# EAGLE design soil_sensor (EAGLE 9.6.2)
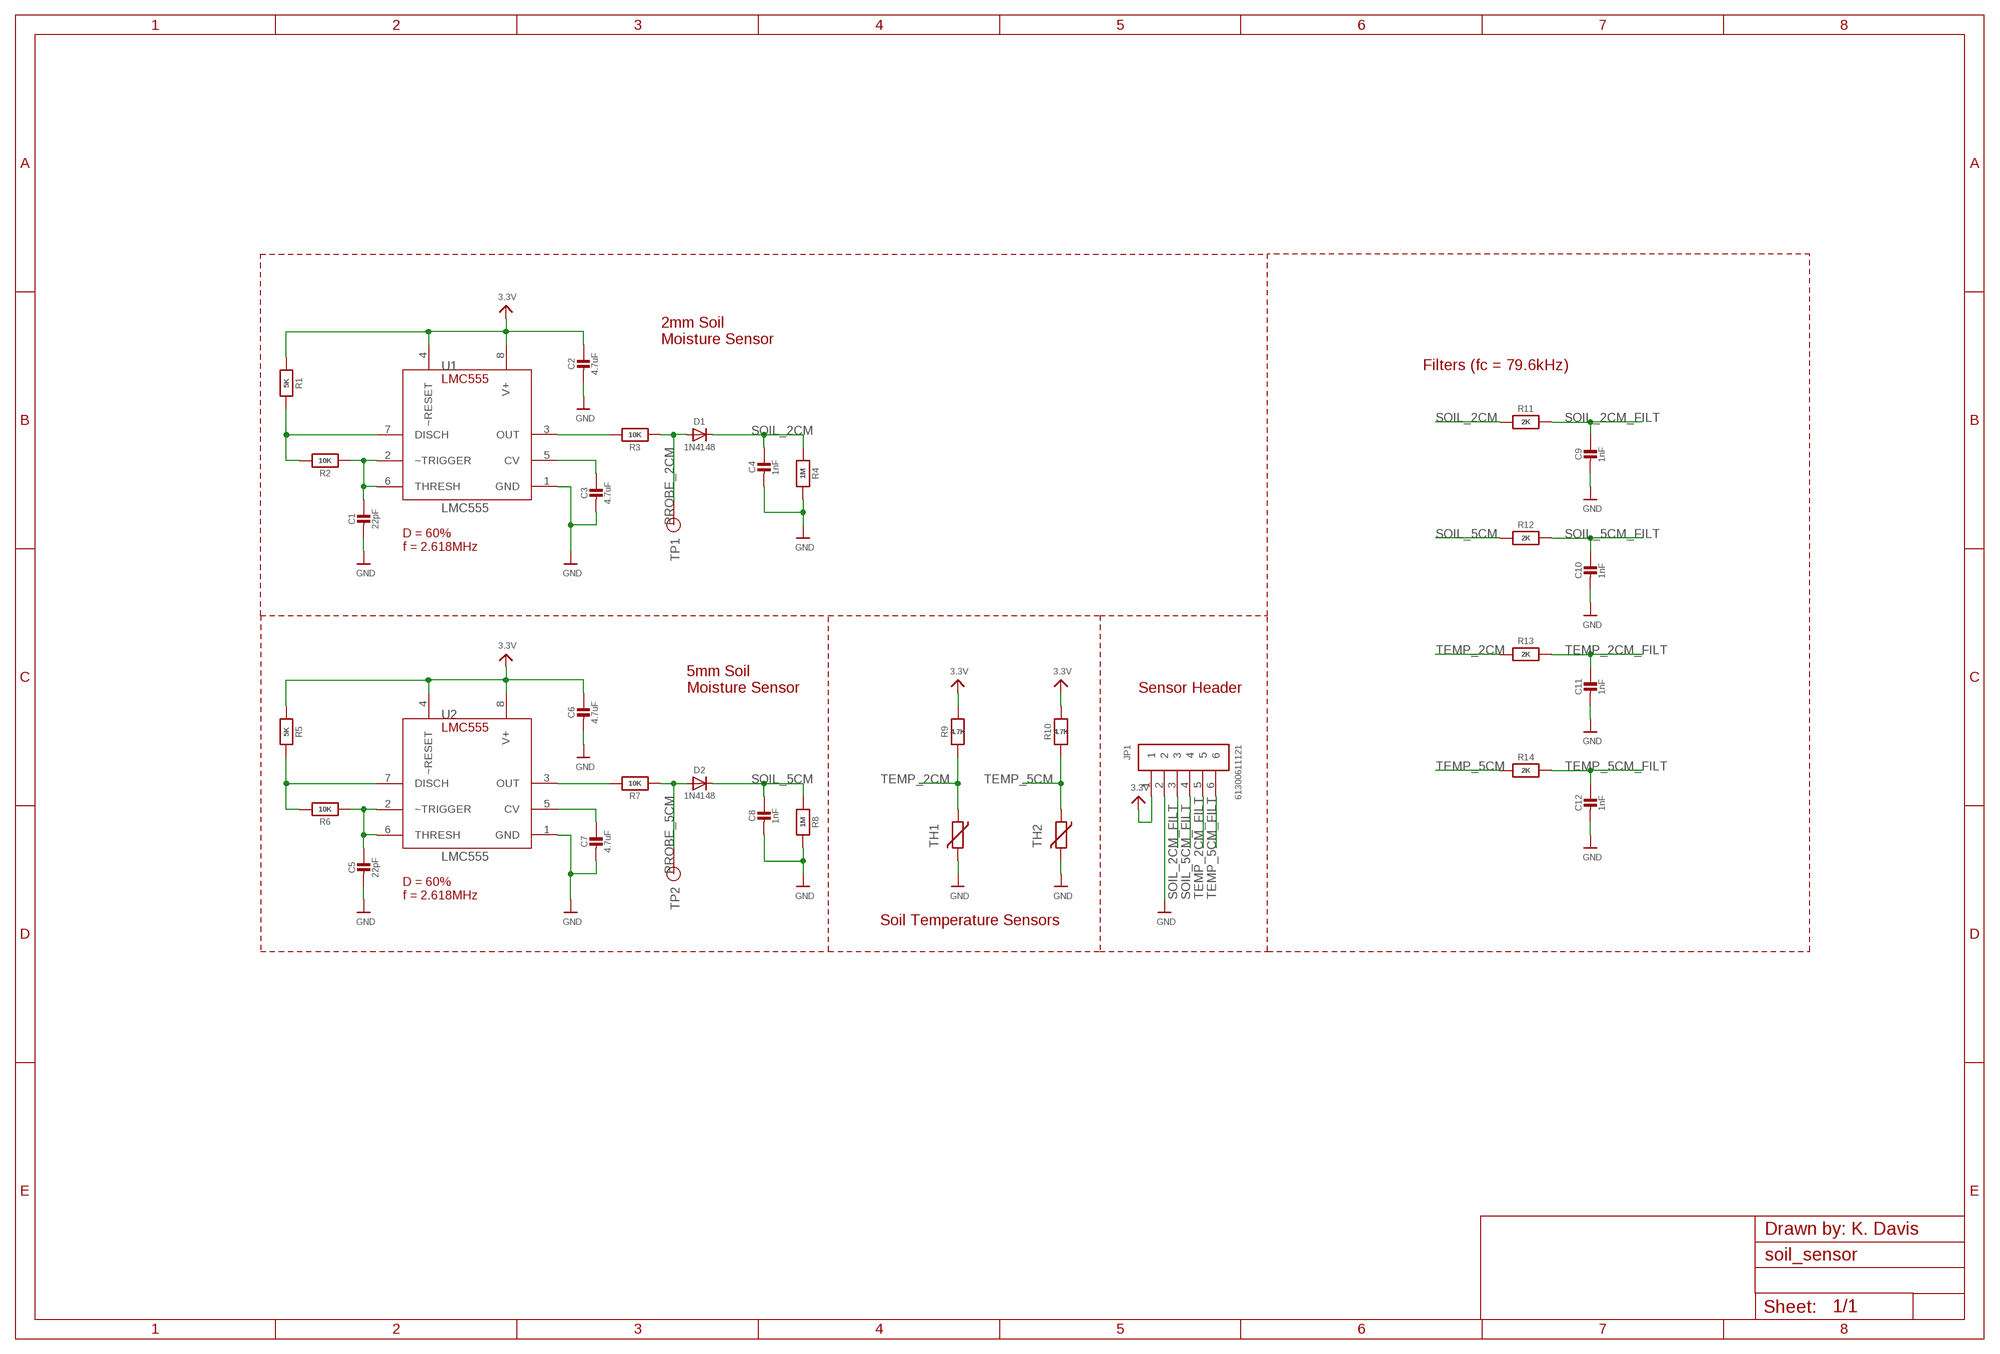
[diagram p0: schematic, sheet 1]

## Parts
C1  22pF  CAP_CERAMIC0805-NOOUTLINE  [0805-NO]
C2  4.7uF  CAP_CERAMIC0805-NOOUTLINE  [0805-NO]
C3  4.7uF  CAP_CERAMIC0805-NOOUTLINE  [0805-NO]
C4  1nF  CAP_CERAMIC0805-NOOUTLINE  [0805-NO]
C5  22pF  CAP_CERAMIC0805-NOOUTLINE  [0805-NO]
C6  4.7uF  CAP_CERAMIC0805-NOOUTLINE  [0805-NO]
C7  4.7uF  CAP_CERAMIC0805-NOOUTLINE  [0805-NO]
C8  1nF  CAP_CERAMIC0805-NOOUTLINE  [0805-NO]
C9  1nF  CAP_CERAMIC0805-NOOUTLINE  [0805-NO]
C10  1nF  CAP_CERAMIC0805-NOOUTLINE  [0805-NO]
C11  1nF  CAP_CERAMIC0805-NOOUTLINE  [0805-NO]
C12  1nF  CAP_CERAMIC0805-NOOUTLINE  [0805-NO]
D1  1N4148  DIODESOD-323  [SOD-323]
D2  1N4148  DIODESOD-323  [SOD-323]
JP1  61300611121  [61300611121]
R1  5K  RESISTOR0805_NOOUTLINE  [0805-NO]
R2  10K  RESISTOR0805_NOOUTLINE  [0805-NO]
R3  10K  RESISTOR0805_NOOUTLINE  [0805-NO]
R4  1M  RESISTOR0805_NOOUTLINE  [0805-NO]
R5  5K  RESISTOR0805_NOOUTLINE  [0805-NO]
R6  10K  RESISTOR0805_NOOUTLINE  [0805-NO]
R7  10K  RESISTOR0805_NOOUTLINE  [0805-NO]
R8  1M  RESISTOR0805_NOOUTLINE  [0805-NO]
R9  4.7K  RESISTOR0805_NOOUTLINE  [0805-NO]
R10  4.7K  RESISTOR0805_NOOUTLINE  [0805-NO]
R11  2K  RESISTOR_0603_NOOUT  [0603-NO]
R12  2K  RESISTOR_0603_NOOUT  [0603-NO]
R13  2K  RESISTOR_0603_NOOUT  [0603-NO]
R14  2K  RESISTOR_0603_NOOUT  [0603-NO]
TH1  VARISTORCN1206  [CT/CN1206]
TH2  VARISTORCN1206  [CT/CN1206]
TP1  TP  [TP_50MIL_CIRC]
TP2  TP  [TP_50MIL_CIRC]
U1  LMC555  [SOIC-8]
U2  LMC555  [SOIC-8]

## Nets
3.3V: C2.1 C6.1 JP1.1 R1.1 R5.1 R9.2 R10.2 U1.4(~RESET) U1.8(V+) U2.4(~RESET) U2.8(V+)
GND: C1.2 C2.2 C3.2 C4.2 C5.2 C6.2 C7.2 C8.2 C9.2 C10.2 C11.2 C12.2 JP1.2 R4.2 R8.2 TH1.2 TH2.2 U1.1(GND) U2.1(GND)
N$12: C1.1 R2.1 U1.2(~TRIGGER) U1.6(THRESH)
N$14: R1.2 R2.2 U1.7(DISCH)
N$15: C3.1 U1.5(CV)
N$16: C5.1 R6.1 U2.2(~TRIGGER) U2.6(THRESH)
N$19: R5.2 R6.2 U2.7(DISCH)
N$20: R3.2 U1.3(OUT)
N$21: C7.1 U2.5(CV)
N$22: R7.2 U2.3(OUT)
PROBE_2CM: D1.A R3.1 TP1.1(TP)
PROBE_5CM: D2.A R7.1 TP2.1(TP)
SOIL_2CM: C4.1 D1.C R4.1 R11.1
SOIL_2CM_FILT: C9.1 JP1.3 R11.2
SOIL_5CM: C8.1 D2.C R8.1 R12.1
SOIL_5CM_FILT: C10.1 JP1.4 R12.2
TEMP_2CM: R9.1 R13.1 TH1.1
TEMP_2CM_FILT: C11.1 JP1.5 R13.2
TEMP_5CM: R10.1 R14.1 TH2.1
TEMP_5CM_FILT: C12.1 JP1.6 R14.2

## Notes on the sheet
- 2mm Soil
  Moisture Sensor
- Filters (fc = 79.6kHz)
- D = 60%
  f = 2.618MHz
- 5mm Soil
  Moisture Sensor
- Sensor Header
- D = 60%
  f = 2.618MHz
- Soil Temperature Sensors
- Drawn by: K. Davis

## Library data of the parts
C1-C12 = microbuilder:CAP_CERAMIC: Ceramic Capacitors For new designs, use the packages preceded by an '_' character since they are more reliable: The following footprints should be used on most boards: _0402 - Standard footprint for regular board layouts _0603 - Standard footprint for regular board layouts _0805 - Standard footprint for regular board layouts _1206 - Standard footprint for regular board layouts For extremely tight-pitch boards where space is at a premium, the following 'micro-pitch' footprints can be used (smaller pads, no silkscreen outline, etc.): _0402MP - Micro-pitch footprint for very dense/compact boards _0603MP - Micro-pitch footprint for very dense/compact boards _0805MP - Micro-pitch footprint for very dense/compact boards _1206MP - Micro-pitch footprint for very dense/compact boards
D1 D2 = microbuilder:DIODE: Diode SMA Model Volts Amps Type Vf Ir Digikey # Notes SSA34-E3 40V 3A Schottky 480mV @ 3A 200uA @ 40V SSA34-E3/61TGITR-ND CDBA120-G 20V 1A Schottky 500mV @ 1A 500uA @ 20V 641-1014-6-ND REEL MBRA210 10V 2A Schottky 350mV @ 2A 700uA @ 10V MBRA210LT3 SOD-123 Model Volts Amps Type Vf Ir Order # Notes BAT54T1G 30V 200mA Schottky 800mV @ 200mA 2uA @ 25V BAT54T1GOSTR-ND B0530W 30V 500mA Schottky 430mV @ 500mA 130uA @ 30V B0530W-FDICT-ND REEL MBR120 20V 1A Schottky 340mV @ 1A MBR120VLSFT1GOSCT-ND SOD-323 Model Volts Amps Type Vf Ir Order # Notes PMEG2005EJ 20V 500mA Schottky 355mV @ 500mA 568-4110-1-ND ZLLS410 10V 570mA Schottky 380mV @ 570mA ZLLS410CT-ND 1N4148WS 75V 150mA Silicon/Simple 1V 1N4148WSFSCT-ND REEL SOD-523 Model Volts Amps Type Vf Ir Order # Notes BAT54XV2 30V 200mA Schottky 0.8V @ 100mA BAT54XV2CT-ND TB751S 30V 30mA Schottky RB751S-40TE61CT-ND SOT23-R/W (R = Solder Paste/Reflow Ovens, W = Hand-Soldering) Model Volts Amps Type Vf Ir Order # Notes BAT54FILM 40V 300mA Schottky 497-7162-1-ND POWERDI-5 Model Volts Amps Type Vf Ir Order # Notes PDS560 60V 5A Schottky 670mV @ 5A 150uA @ 60V PDS560DICT-ND
JP1 = EarthPodLib:61300611121: CONN HEADER VERT 5POS 2.54MM Manufacturer's datasheet <https://katalog.we-online.de/em/datasheet/6130xx11121.pdf>; CREATED_BY: PCBLayout.com; DIGI_KEY_PART_NUMBER: 732-5318-ND; MANUFACTURER: Wurth Electronics Inc.; MPN: 61300511121
R1-R14 = microbuilder:RESISTOR: Resistors For new designs, use the packages preceded by an '_' character since they are more reliable: The following footprints should be used on most boards: _0402 - Standard footprint for regular board layouts _0603 - Standard footprint for regular board layouts _0805 - Standard footprint for regular board layouts _1206 - Standard footprint for regular board layouts For extremely tight-pitch boards where space is at a premium, the following 'micro-pitch' footprints can be used (smaller pads, no silkscreen outline, etc.): _0402MP - Micro-pitch footprint for very dense/compact boards _0603MP - Micro-pitch footprint for very dense/compact boards _0805MP - Micro-pitch footprint for very dense/compact boards _1206MP - Micro-pitch footprint for very dense/compact boards
TH1 TH2 = varistor:VARISTOR: VARISTOR
TP1 TP2 = EarthPodLib:TP
U1 U2 = EarthPodLib:LMC555

## Net classes
1 highpower: width 0.305 mm, drill 0.483 mm
2 lowpower: width 0.254 mm, drill 0.483 mm

## Board
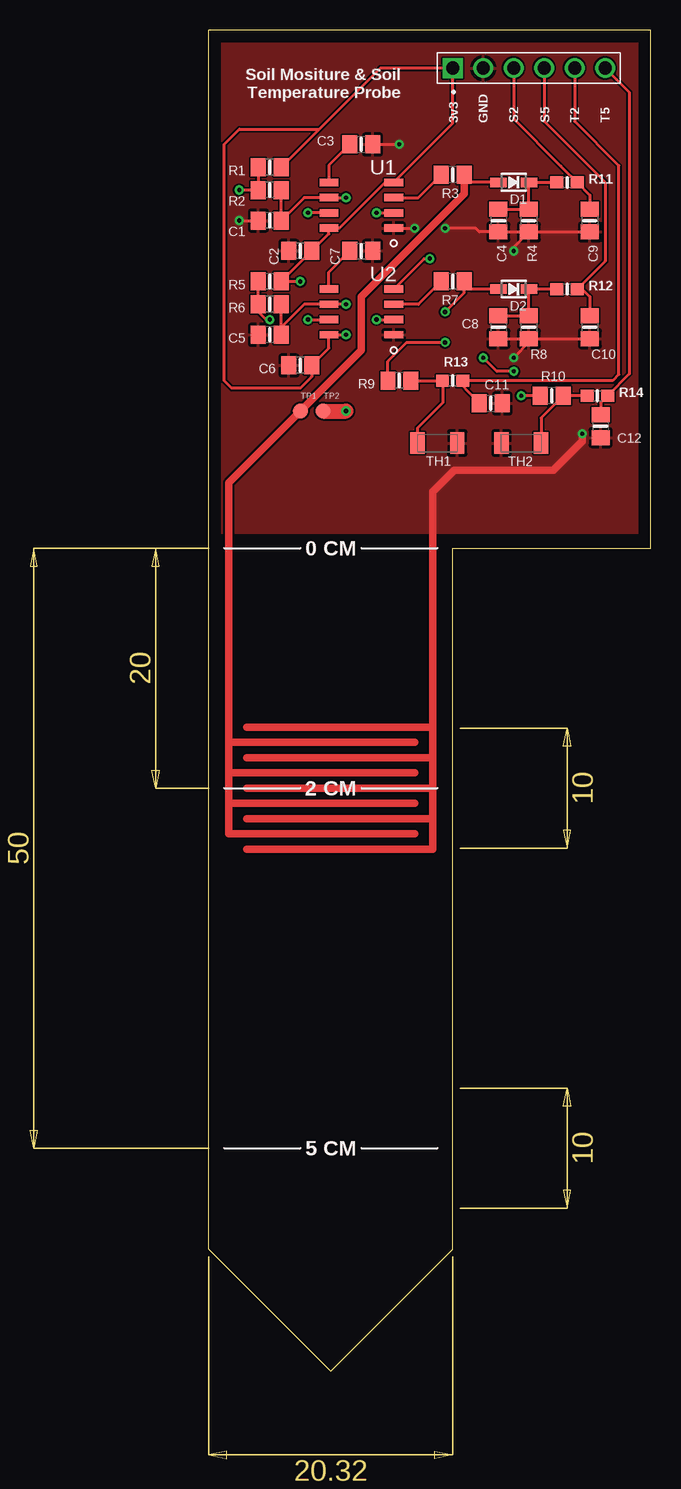
[diagram p1: board, top side]
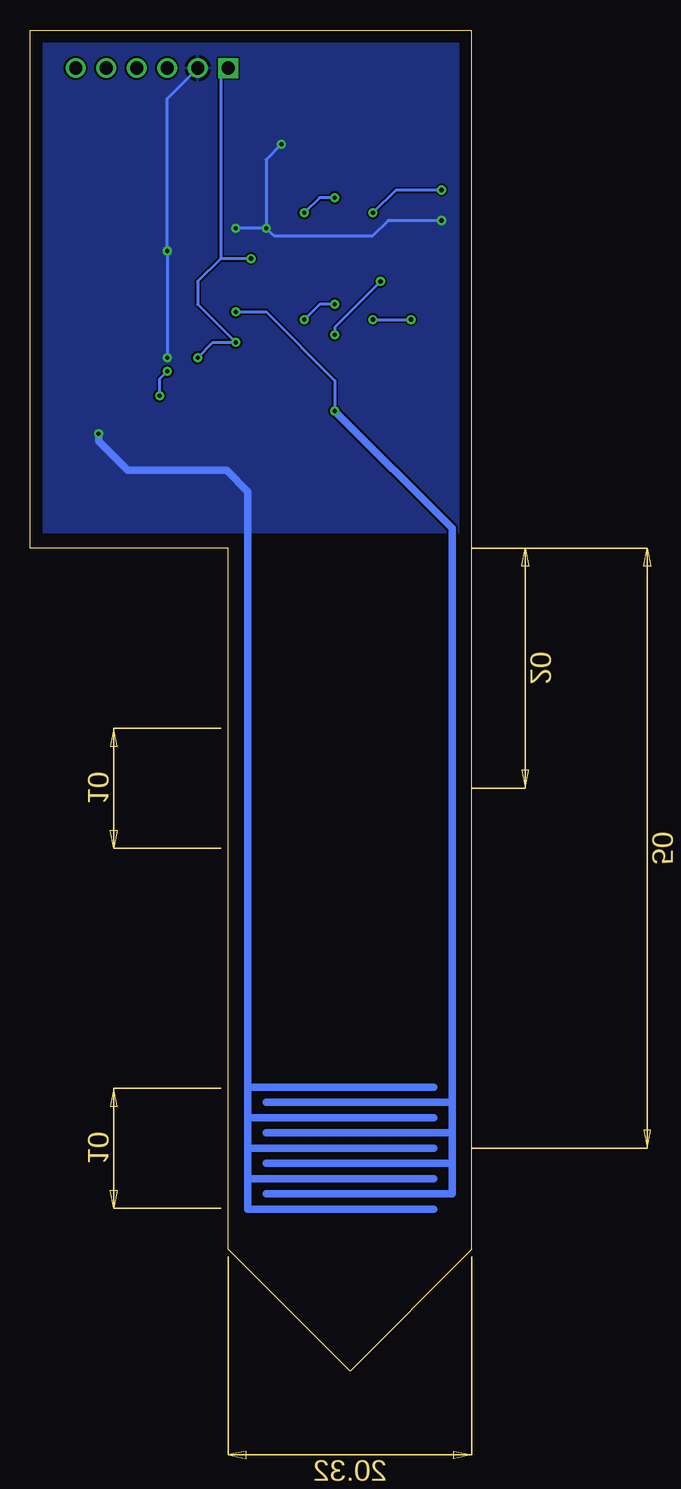
[diagram p2: board, bottom side, seen from below]

Size 36.83 x 111.76 mm. Coordinates in mm from the lower left corner, seen from the top.
Outline: 36.83,68.58 36.83,111.76 0,111.76 0,10.16 10.16,0 20.32,10.16 20.32,68.58 36.83,68.58
Copper layers (1*16): Top 0.035mm / dielectric 1.5mm / Bottom 0.035mm
Design rules "default *": minimum track width 6mil, minimum drill 0.35mm, track to track 6mil, track to pad 6mil, pad to pad 6mil, via to via 6mil, smd to smd 6mil, copper to edge 40mil, drill to drill 6mil, minimum pad ring 10mil, minimum via ring 8mil, stop-mask expansion 4mil, vias tented up to drill 0mil, thermal gap 10mil

### Footprints (pad centres in the part's own frame; a part is rotated, then mirrored left to right if it is on the bottom)
0805-NO = smd 1.24 x 1.5: 1 -0.95,0; 2 0.95,0
SOD-323 = smd 1.35 x 0.8: A 1.27,0; C -1.27,0
61300611121 = drill 1.1 square: 1 -6.35,0 | drill 1.1: 2 -3.81,0; 3 -1.27,0; 4 1.27,0; 5 3.81,0; 6 6.35,0
0603-NO = smd 1.075 x 1: 1 -0.85,0; 2 0.85,0
CT/CN1206 = smd 1.2 x 1.8: 1 -1.65,0; 2 1.65,0
TP_50MIL_CIRC = smd 1.27 x 1.27: 1 0,0
SOIC-8 = smd 1.549 x 0.61: 1 -2.705,1.905; 2 -2.705,0.635; 3 -2.705,-0.635; 4 -2.705,-1.905; 5 2.705,-1.905; 6 2.705,-0.635; 7 2.705,0.635; 8 2.705,1.905

### Placement (x,y rotation side)
C1  5.08,95.88 180 top
C2  7.62,93.34 180 top
C3  12.7,102.23 0 top
C4  24.13,95.88 270 top
C5  5.08,86.36 180 top
C6  7.62,83.82 180 top
C7  12.7,93.34 0 top
C8  24.13,86.99 270 top
C9  31.75,95.88 270 top
C10  31.75,86.99 270 top
C11  23.5,80.64 0 top
C12  32.64,78.74 270 top
D1  25.4,99.06 180 top
D2  25.4,90.17 180 top
JP1  26.67,108.58 0 top
R1  5.08,100.33 180 top
R2  5.08,98.42 180 top
R3  20.32,99.69 180 top
R4  26.67,95.88 270 top
R5  5.08,90.8 180 top
R6  5.08,88.9 180 top
R7  20.32,90.8 180 top
R8  26.67,86.99 270 top
R9  15.88,82.55 180 top
R10  28.57,81.28 180 top
R11  29.84,99.06 0 top
R12  29.84,90.17 0 top
R13  20.32,82.55 0 top
R14  32.38,81.28 0 top
TH1  19.05,77.34 0 top
TH2  26.04,77.34 180 top
TP1  7.62,80.01 0 top
TP2  9.53,80.01 0 top
U1  12.7,97.16 180 top
U2  12.7,88.27 180 top

### Tracks (layer width: path | path; a pad name or v marks a point on that pad's centre or on a via)
3.3V  (via drill 0.35)
  Top 0.254: R9.2 14.93,84.14 16.51,85.72 v19.68,85.72 | v25.4,83.31 24,83.31 v22.86,84.45 | R10.2 v26.04,81.28 | v7.62,90.8 R5.1 C2.1 9.99,94.77 U1.8 10.88,95.25 14.69,99.06 U1.4 20.32,103.97 JP1.1 14.29,108.58 9.21,103.5 | v11.43,86.36 U2.8 9.99,85.24 C6.1 8.57,82.86 7.62,81.91 1.91,81.91 1.27,82.55 1.27,102.23 2.54,103.5 9.21,103.5 | R1.1 9.21,103.5 | U2.4 17.95,92.71 v18.41,92.71
  Bottom 0.254: JP1.1 20.95,107.95 20.95,92.71 | v26.04,81.28 26.04,82.68 v25.4,83.31 | v22.86,84.45 21.59,85.72 v19.68,85.72 22.86,88.9 22.86,90.8 20.95,92.71 | v7.62,90.8 11.43,86.99 v11.43,86.36 | v18.41,92.71 20.95,92.71
GND  (via drill 0.35)
  Top 0.254: C8.2 R8.2 | R8.2 C10.2 | R4.2 C4.2 22.54,94.94 22.23,95.25 v19.68,95.25 | R4.2 C9.2 | v25.4,93.34 25.4,93.66 R4.2 | R8.2 26.67,85.72 v25.4,84.45 | U1.1 v17.14,95.25 | C3.2 v15.88,102.23 | v2.54,95.88 C1.2
  Top 0.635: v31.11,78.1 31.11,77.47 28.7,75.06 20.45,75.06 18.67,73.28 18.67,53.66 | 18.67,53.66 18.67,51.12 | 18.67,51.12 18.67,48.58 | 18.67,48.58 18.67,46.04 | 18.67,46.04 18.67,43.5 3.17,43.5 | 18.67,48.58 3.17,48.58 | 18.67,53.66 3.17,53.66 | 18.67,46.04 3.17,46.04 | 18.67,51.12 3.17,51.12
  Bottom 0.254: v25.4,84.45 v25.4,93.34 25.4,106.05 JP1.2 | v15.88,102.23 17.14,100.97 v17.14,95.25 | v2.54,95.88 6.99,95.88 8.26,94.61 16.51,94.61 v17.14,95.25 | v17.14,95.25 v19.68,95.25
  Bottom 0.635: v31.11,78.1 31.11,77.47 28.7,75.06 20.45,75.06 18.67,73.28 18.67,23.66 | 18.67,23.66 18.67,21.12 | 18.67,21.12 18.67,18.58 | 18.67,18.58 18.67,16.04 | 18.67,16.04 18.67,13.5 3.17,13.5 | 18.67,18.58 3.17,18.58 | 18.67,23.66 3.17,23.66 | 18.67,16.04 3.17,16.04 | 18.67,21.12 3.17,21.12
  pour Top: -4.45,69.85 41.91,69.85 41.91,115.57 -4.45,115.57
  pour Bottom: -5.71,69.85 43.18,69.85 43.18,116.84 -5.71,116.84
N$12  (via drill 0.35)
  Top 0.254: v11.43,97.79 U1.6 7.93,97.79 C1.1 R2.1 | v13.97,96.52 U1.2
  Bottom 0.254: v11.43,97.79 12.7,97.79 v13.97,96.52
N$14  (via drill 0.35)
  Top 0.254: R1.2 R2.2 v2.54,98.42 | U1.7 v8.26,96.52
  Bottom 0.254: v2.54,98.42 6.35,98.42 v8.26,96.52
N$15
  Top 0.254: C3.1 9.99,100.48 U1.5
N$16  (via drill 0.35)
  Top 0.254: v11.43,88.9 U2.6 7.93,88.9 6.03,86.99 C5.1 R6.1 | v13.97,87.63 U2.2
  Bottom 0.254: v11.43,88.9 12.7,88.9 v13.97,87.63
N$19  (via drill 0.35)
  Top 0.254: R5.2 R6.2 4.13,88.27 4.76,87.63 v5.08,87.63 | v8.26,87.63 U2.7
  Bottom 0.254: v8.26,87.63 v5.08,87.63
N$20
  Top 0.254: R3.2 17.46,97.79 U1.3
N$21
  Top 0.254: U2.5 9.99,91.59 C7.1
N$22
  Top 0.254: R7.2 17.46,88.9 U2.3
PROBE_2CM
  Top 0.254: D1.A 21.91,99.06 R3.1
  Top 0.635: R3.1 21.27,98.1 12.7,89.53 12.7,85.09 TP1.1 1.65,74.04 1.65,52.39 | 1.65,47.31 1.65,49.85 | 1.65,49.85 1.65,52.39 | 1.65,47.31 1.65,44.77 17.14,44.77 | 1.65,47.31 17.14,47.31 | 1.65,49.85 17.14,49.85 | 1.65,52.39 17.14,52.39
PROBE_5CM  (via drill 0.35)
  Top 0.254: v19.68,88.27 21.27,89.85 R7.1 21.91,90.17 D2.A
  Top 1.27: TP2.1 v11.43,80.01
  Bottom 0.254: v19.68,88.27 17.14,88.27 11.43,82.55 v11.43,80.01
  Bottom 0.635: v11.43,80.01 1.65,70.23 1.65,22.39 | 1.65,22.39 1.65,19.85 | 1.65,17.31 1.65,14.77 17.14,14.77 | 1.65,17.31 1.65,19.85 | 1.65,22.39 17.14,22.39 | 1.65,19.85 17.14,19.85 | 1.65,17.31 17.14,17.31
SOIL_2CM
  Top 0.254: C4.1 R4.1 D1.C R11.1
SOIL_2CM_FILT
  Top 0.152: 31.75,98 30.91,98.85 R11.2 29.33,100.42 | 31.75,97.16 C9.1
  Top 0.254: JP1.3 25.4,104.35 29.33,100.42 30.91,98.85 | R11.2 31.75,98 31.75,97.16
SOIL_5CM
  Top 0.254: R12.1 D2.C R8.1 C8.1
SOIL_5CM_FILT
  Top 0.254: C10.1 31.75,89.53 31.11,90.17 R12.2 33.02,92.49 33.02,99.06 27.94,104.14 JP1.4
TEMP_2CM
  Top 0.254: R9.1 R13.1 19.47,80.68 17.4,78.61 TH1.1
TEMP_2CM_FILT
  Top 0.254: C11.1 20.95,82.33 R13.2 33.66,82.55 34.16,83.06 34.16,100.46 30.48,104.14 JP1.5
TEMP_5CM
  Top 0.254: TH2.1 27.68,79.44 R10.1 R14.1
TEMP_5CM_FILT
  Top 0.254: C12.1 32.64,80.68 R14.2 35.05,83.1 35.05,106.55 JP1.6

### Text on the board
tNames: Soil Mositure & Soil / Temperature Probe | 3v3 | GND | S2 | S5 | T2 | T5 | 0 CM | 2 CM | 5 CM